# Altium schematic sheet ui_lcd.SchDoc: mcHF Pro Transceiver UI board
size A3; Author: Krassi Atanassov; CompanyName: MØNKA; Engineer: For radio amateurs experimentation, non-commercial use only. Thank you!; Revision: 0.8.5; SheetTotal: 13
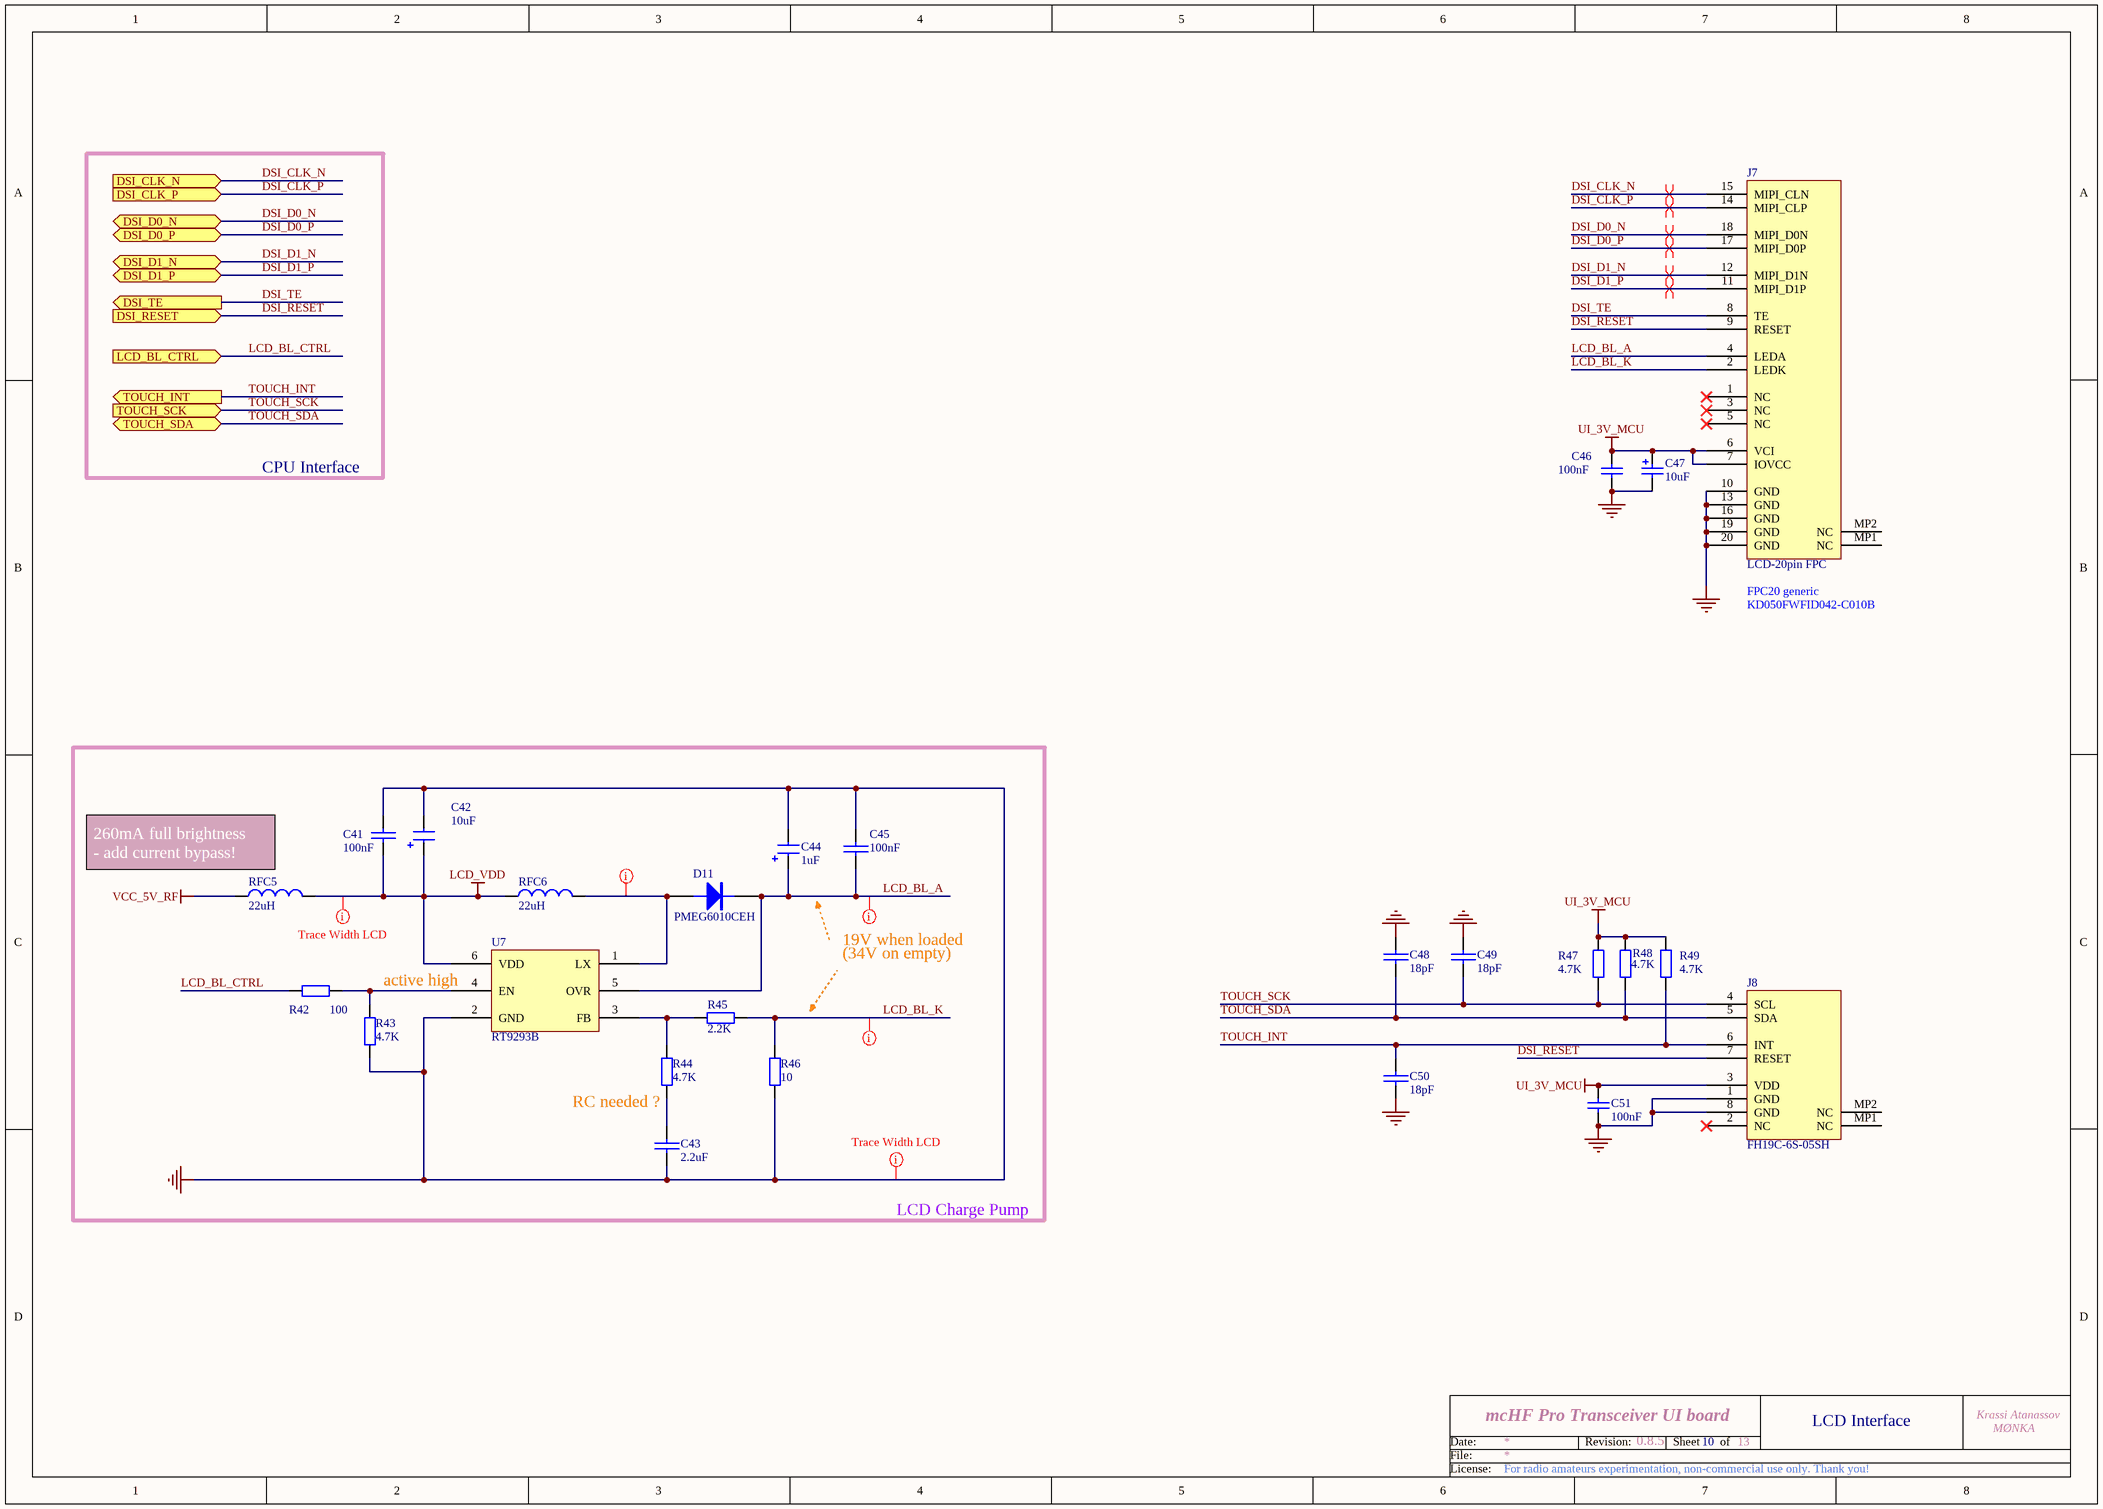
[diagram p0: ui_lcd.SchDoc]

## Parts
C41  100nF  [0805]
C42  10uF  [1206_Elec_Cap]
C43  2.2uF  [0805]
C44  1uF  [1206_Elec_Cap]
C45  100nF  [0805]
C46  100nF  [0805]
C47  10uF  [1206_Elec_Cap]
C48  18pF  [0805]
C49  18pF  [0805]
C50  18pF  [0805]
C51  100nF  [0805]
D11  PMEG6010CEH  [SOD87]
J7  LCD-20pin FPC  [MOLX-52746-2071]
J8  FH19C-6S-05SH  [MOLX-501461-0891]
R42  100  [0805]
R43  4.7K  [0805]
R44  4.7K  [0805]
R45  2.2K  [0805]
R46  10  [1206]
R47  4.7K  [0805]
R48  4.7K  [0805]
R49  4.7K  [0805]
RFC5  22uH  [0805]
RFC6  22uH  [0805]
U7  RT9293B  [SOT25-6]

## Ports
DSI_CLK_N (in), DSI_CLK_P (in), DSI_D0_N (bidir), DSI_D0_P (bidir), DSI_D1_N (bidir), DSI_D1_P (bidir), DSI_RESET (in), DSI_TE (out), LCD_BL_CTRL (in), TOUCH_INT (out), TOUCH_SCK (in), TOUCH_SDA (bidir)

## Nets
GND: C41.1 C42.2 C43.2 C44.2 C45.1 C46.1 C47.2 C48.1 C49.1 C50.2 C51.1 J7.10(GND) J7.13(GND) J7.16(GND) J7.19(GND) J7.20(GND) J8.1(GND) J8.8(GND) R43.1 R46.1 U7.2(GND)
LCD_VDD: C41.2 C42.1 RFC5.2 RFC6.1 U7.6(VDD)
UI_3V_MCU: C46.2 C47.1 C51.2 J7.6(VCI) J7.7(IOVCC) J8.3(VDD) R47.1 R48.1 R49.1
VCC_5V_RF: RFC5.1
DSI_CLK_N: J7.15(MIPI_CLN) ; port DSI_CLK_N
DSI_CLK_P: J7.14(MIPI_CLP) ; port DSI_CLK_P
DSI_D0_N: J7.18(MIPI_D0N) ; port DSI_D0_N
DSI_D0_P: J7.17(MIPI_D0P) ; port DSI_D0_P
DSI_D1_N: J7.12(MIPI_D1N) ; port DSI_D1_N
DSI_D1_P: J7.11(MIPI_D1P) ; port DSI_D1_P
DSI_RESET: J7.9(RESET) J8.7(RESET) ; port DSI_RESET
DSI_TE: J7.8(TE) ; port DSI_TE
LCD_BL_A: C44.1 C45.2 D11.2(K) J7.4(LEDA) U7.5(OVR)
LCD_BL_CTRL: R42.1 ; port LCD_BL_CTRL
LCD_BL_K: J7.2(LEDK) R45.2 R46.2
TOUCH_INT: C50.1 J8.6(INT) R49.2 ; port TOUCH_INT
TOUCH_SCK: C49.2 J8.4(SCL) R47.2 ; port TOUCH_SCK
TOUCH_SDA: C48.2 J8.5(SDA) R48.2 ; port TOUCH_SDA
NetC43_1: C43.1 R44.1
NetD11_1: D11.1(A) RFC6.2 U7.1(LX)
NetR42_2: R42.2 R43.2 U7.4(EN)
NetR44_2: R44.2 R45.1 U7.3(FB)

Not connected (* = marked no-connect by the designer): J7 1(NC)* 3(NC)* 5(NC)* MP1(NC) MP2(NC); J8 2(NC)* MP1(NC) MP2(NC)

## Layout directives
rule Width Constraint [Pref Width = 20mil    Min Width = 20mil    Max Width = 20mil]: GND, LCD_VDD
rule Width Constraint [Pref Width = 15mil    Min Width = 15mil    Max Width = 15mil]: NetD11_1
rule Width Constraint [Pref Width = 10mil    Min Width = 10mil    Max Width = 10mil]: LCD_BL_A, LCD_BL_K
differential pair: DSI_CLK_N, DSI_CLK_P, DSI_D0_N, DSI_D0_P, DSI_D1_N, DSI_D1_P

## Notes on the sheet
- CPU Interface
- KD050FWFID042-C010B
- (near J7) FPC20 generic
- (near RFC5) 260mA full brightness     - add current bypass!
- (near U7) active high
- 19V when loaded
- (34V on empty)
- (near R44) RC needed ?
- LCD Charge Pump
- 10
- LCD Interface
- Date:
- File:
- Revision:
- Sheet
- of
- License:

## Library data of the parts
C41 C45 = CAP: Capacitor; Order: FN 282-1264; QT Order: QCC-00157; Price: 0.089
C42 = CAP-POL: Electrolitic capacitor; Order: FN 145-7414; QT Order: QCC-00166; Price: 0.30
C43 = CAP: Ceramic Capacitor; Order: FN 175-9477; QT Order: QCC-00447; Price: 0.114
C44 = CAP-POL: Electrolitic capacitor; Order: FN 145-7406; QT Order: QCC-00172; Voltage: 50V; Price: 0.235
C46 C51 = CAP: Capacitor; Value: 100pF; Published: 8-Jun-2000; Revision: July-2002: Re-released for DXP Platform.; Publisher: Altium Limited
C47 = Cap Pol1: Published: 8-Jun-2000; Revision: July-2002: Re-released for DXP Platform.; Publisher: Altium Limited
C48-C50 = CAP: Capacitor; Notes: COG/NPO; Voltage: 100V
D11 = PMEG6010CEH: DIODE, SCHOTTKY, 1A, 60V, SOD-123F; Order: FN 151-0694; QT Order: QCD-00034; QT Price: 0.08; Price: 0.262
J7 = KD050FWFID042-C010B: LCD-20pin FPC, Top contacts position; Order: FN 3215802; Notes: FPC Board Connector, 0.5 mm, 20 Contacts, Receptacle, Top contacts position!
J8 = FPC8: 8 pin FPC, Top contacts position; Order: FN 2614916; Notes: FPC Board Connector, 0.5 mm, 8 Contacts, Receptacle,Top contact position
R42 = RES: Resistor; Order: FN 157-6459; QT Order: QCR-00326; Price: 0.061
R43 R44 R47-R49 = RES: Resistor; Order: FN 200-8383; QT Order: QCR-00341
  R43 R44: Price: 0.03
  R47-R49: Price: 0.024
R45 = RES: Resistor; Order: FN 188-7289; QT Order: QCR-00333; QT Price: 0.03; Price: 0.075
R46 = RES: Resistor; Order: FN 207-3875; QT Order: QCR-00419; QT Price: 0.03; Notes: What is the biggest power rating to fit into 1206 ?; Price: 0.024
RFC5 = Inductor: Power Inductor; QT Order: QCL-00097; QT Price: 0.085; Notes: Don't we already have selection for 0.8.0(bigger than 0805) ?; Price: 0
RFC6 = Inductor: Power Inductor; QT Order: QCL-00097; QT Price: 0.085; Price: 0
U7 = RT9293B: Charge Pump; Order: Hotmcu.com; QT Order: QCI-01775; QT Price: 0.27; Notes: Originally from Thomas, if not Ali; Price: 0.5